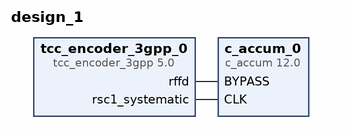
[diagram p0: block diagram of the top level]
# Vivado block design design_1, xc7s100fgga676-2, Vivado 2024.2
create_bd_design design_1

create_bd_cell -type ip -vlnv xilinx.com:ip:c_accum:12.0 c_accum_0
create_bd_cell -type ip -vlnv xilinx.com:ip:tcc_encoder_3gpp:5.0 tcc_encoder_3gpp_0

# ---- connections ----

connect_bd_net [get_bd_pins tcc_encoder_3gpp_0/rffd] [get_bd_pins c_accum_0/BYPASS]
connect_bd_net [get_bd_pins tcc_encoder_3gpp_0/rsc1_systematic] [get_bd_pins c_accum_0/CLK]

validate_bd_design
save_bd_design
